# EAGLE design Board (EAGLE 7.7.0)
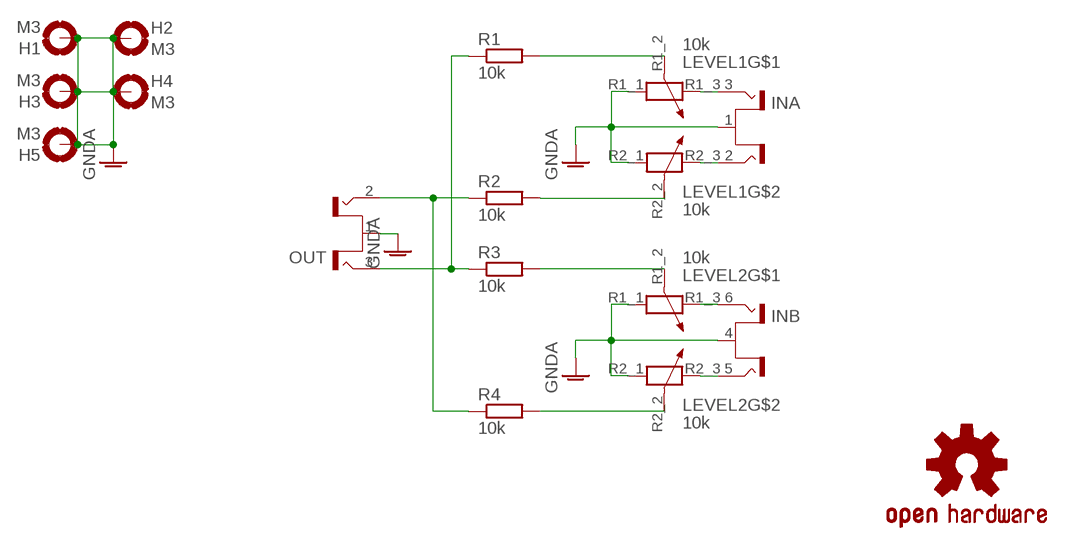
[diagram p0: schematic, sheet 1]

## Parts
H1  M3  MOUNT-PAD-ROUND3.0  [3,0-PAD]
H2  M3  MOUNT-PAD-ROUND3.0  [3,0-PAD]
H3  M3  MOUNT-PAD-ROUND3.0  [3,0-PAD]
H4  M3  MOUNT-PAD-ROUND3.0  [3,0-PAD]
H5  M3  MOUNT-PAD-ROUND3.0  [3,0-PAD]
IN  RCA-4-117-01  [RCA-4-117-01]
LEVEL1  10k  ALPS-RK09L12B0  [ALPS-RK09L12B0]
LEVEL2  10k  ALPS-RK09L12B0  [ALPS-RK09L12B0]
LOGO1  OSHW-LOGOL-COPPER  [OSHW-LOGO-L_COPPER]
OUT  RCA-2-117-01  [RCA-2-117-01]
R1  10k  R-EU_0414/15  [0414/15]
R2  10k  R-EU_0414/15  [0414/15]
R3  10k  R-EU_0414/15  [0414/15]
R4  10k  R-EU_0414/15  [0414/15]

## Nets
GNDA: H1.B3,0(MOUNT) H2.B3,0(MOUNT) H3.B3,0(MOUNT) H4.B3,0(MOUNT) H5.B3,0(MOUNT) IN.1(A:S) IN.4(B:S) LEVEL1.R1_1 LEVEL1.R2_1 LEVEL2.R1_1 LEVEL2.R2_1 OUT.1(S)
N$1: IN.6(B:T2) LEVEL2.R1_3
N$2: IN.3(A:T2) LEVEL1.R1_3
N$3: IN.2(A:T1) LEVEL1.R2_3
N$4: LEVEL1.R1_2 R1.2
N$5: LEVEL1.R2_2 R2.2
N$6: IN.5(B:T1) LEVEL2.R2_3
N$9: LEVEL2.R2_2 R4.2
N$10: LEVEL2.R1_2 R3.2
N$11: OUT.2(T1) R2.1 R4.1
N$12: OUT.3(T2) R1.1 R3.1

## Library data of the parts
H1-H5 = holes:MOUNT-PAD-ROUND: MOUNTING PAD, round
IN = con-conrad:RCA-4-117-01: Cinch-Anschlussplatte 72385 Gold, Rot, Weiß BKL Electronic Conrad Bestellnummer : 736910 - 62 Source: Data sheet <http://www.produktinfo.conrad.com/datenblaetter/725000-749999/736910-da-01-en-Cinch_Anschlussplatte_4polig.pdf>
LEVEL1 LEVEL2 = OwnStuff:ALPS-RK09L12B0
LOGO1 = SparkFun-Aesthetics:OSHW-LOGO: Open Source Hardware Logo This logo indicates the piece of hardware it is found on incorporates a OSHW license and/or adheres to the definition of open source hardware found here: http://freedomdefined.org/OSHW
OUT = con-conrad:RCA-2-117-01: Cinch-Anschlussplatte 72385 Gold, Rot, Weiß BKL Electronic Conrad Bestellnummer : 736910 - 62 Source: Data sheet <http://www.produktinfo.conrad.com/datenblaetter/725000-749999/736910-da-01-en-Cinch_Anschlussplatte_4polig.pdf>
R1-R4 = rcl:R-EU_: RESISTOR, European symbol

## Board
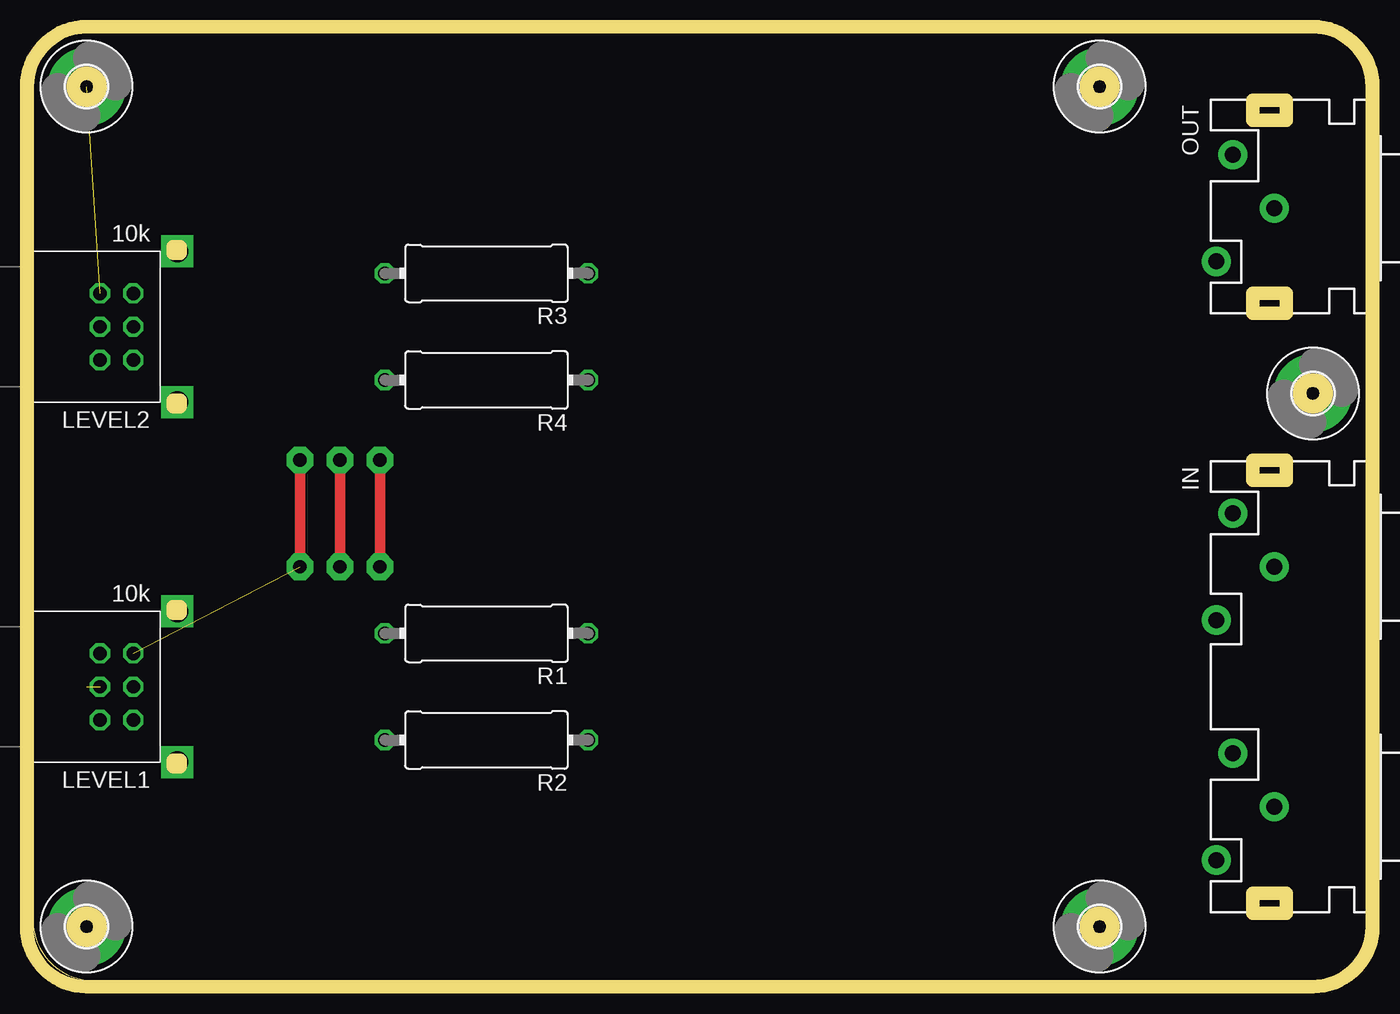
[diagram p1: board, top side]
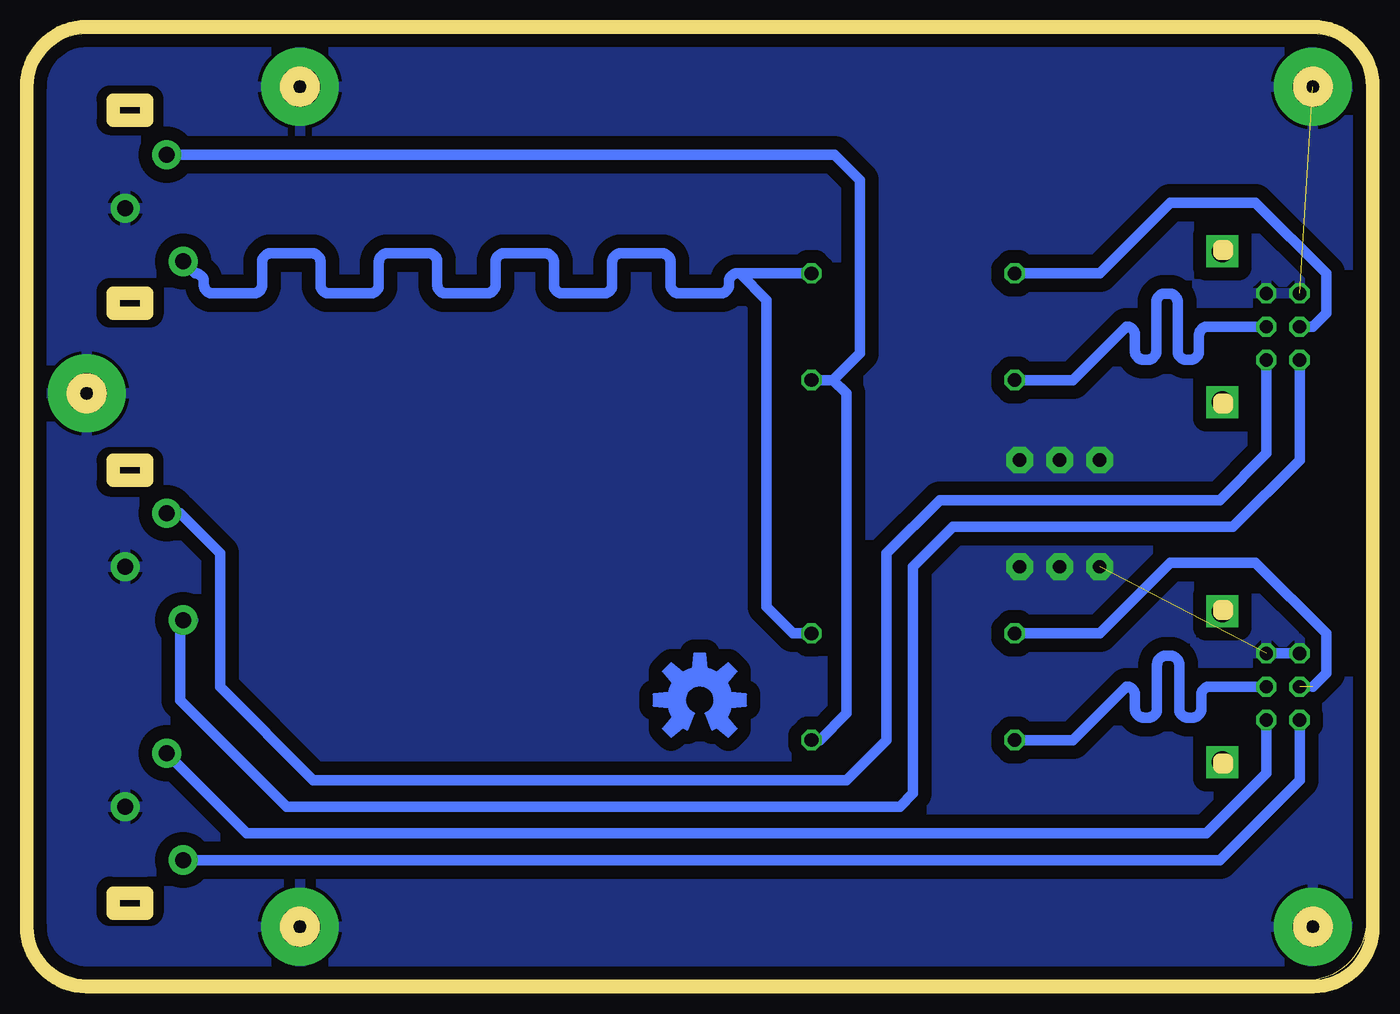
[diagram p2: board, bottom side, seen from below]

Size 100 x 71.03 mm. Coordinates in mm from the lower left corner, seen from the top.
Outline: 0,4.03 arc90 5,0.03 96,0.03 arc90 100,4.03 100,67.03 arc90 96,71.03 4,71.03 arc90 0,67.03 0,4.03
Copper layers (1*16): Top 0.035mm / dielectric 1.5mm / Bottom 0.035mm
Design rules "default *": minimum track width 10mil, minimum drill 24mil, track to track 8mil, track to pad 8mil, pad to pad 8mil, via to via 8mil, smd to smd 8mil, copper to edge 40mil, drill to drill 8mil, minimum pad ring 10mil, minimum via ring 8mil, stop-mask expansion 4mil, vias tented up to drill 0mil, thermal gap 10mil
Milling: 60 lines

### Footprints (pad centres in the part's own frame; a part is rotated, then mirrored left to right if it is on the bottom)
3,0-PAD = drill 3 pad 5.842: B3,0 0,0
RCA-4-117-01 = drill 1.2 pad 2.184: 1 9,3.1; 2 5,0; 3 13,-1.25; 4 -9,3.1; 5 -13,0; 6 -5,-1.25
ALPS-RK09L12B0 = drill 1 octagon: R1_1 2.5,-2.5; R1_2 2.5,0; R1_3 2.5,2.5; R2_1 0,-2.5; R2_2 0,0; R2_3 0,2.5 | drill 1.6 square: S1 -3.3,5.65; S2 -3.3,-5.65
RCA-2-117-01 = drill 1.2 pad 2.184: 1 0.11,3.1; 2 -3.89,0; 3 4.11,-1.25
0414/15 = drill 1.016 octagon: 1 -7.62,0; 2 7.62,0

### Placement (x,y rotation side)
H1  4,4.03 0 top
H2  4,67.03 0 top
H3  80,4.03 0 top
H4  96,44.03 0 top
H5  80,67.03 0 top
IN  90,22.03 270 top
LEVEL1  7.5,22.03 180 top
LEVEL2  7.5,49.03 180 top
LOGO1  50,21.03 0 bottom
OUT  90,58.03 270 top
R1  34,26.03 180 top
R2  34,18.03 180 top
R3  34,53.03 180 top
R4  34,45.03 180 top

### Tracks (layer width: path | path; a pad name or v marks a point on that pad's centre or on a via)
GNDA  (via drill 1 pad 2)  (2 unrouted)
  Top 0.8: v20,31.03 v20,39.03 | v23,31.03 v23,39.03 | v26,39.03 v26,31.03
  Bottom 0.8: LEVEL1.R1_1 LEVEL1.R2_1
  pour Bottom (isolate 1): 0,0.03 100,0.03 100,71.03 0,71.03
N$1
  Bottom 0.8: LEVEL2.R1_3 5,39.03 10,34.03 31,34.03 34,31.03 34,14.03 35,13.03 81,13.03 89,21.03 89,26.78 IN.6 88,27.03
N$2
  Bottom 0.8: LEVEL1.R1_3 5,15.03 11,9.03 IN.3
N$3
  Bottom 0.8: LEVEL1.R2_3 7.5,15.53 12,11.03 84,11.03 IN.2
N$4  (1 unrouted)
  Bottom 0.8: R1.2 20,26.03 14.69,31.33 8.31,31.33 3,26.03 3,23.03 4,22.03
N$5
  Bottom 0.8: R2.2 22,18.03 18,22.03 arc90 17.35,21.37 17.35,20.36 arc-90 16.69,19.71 16.34,19.71 arc-90 15.69,20.36 15.69,23.69 arc90 15.04,24.34 14.69,24.34 arc90 14.03,23.69 14.03,20.36 arc-90 13.38,19.71 13.03,19.71 arc-90 12.38,20.36 12.38,21.37 arc90 11.72,22.03 LEVEL1.R2_2
N$6
  Bottom 0.8: LEVEL2.R2_3 7.5,39.53 11,36.03 32,36.03 36,32.03 36,18.03 39,15.03 79,15.03 86,22.03 86,32.03 89,35.03 IN.5
N$9
  Bottom 0.8: R4.2 22,45.03 18,49.03 arc90 17.35,48.37 17.35,47.2 arc-90 16.69,46.54 16.4,46.54 arc-90 15.74,47.2 15.74,50.86 arc90 15.09,51.51 14.8,51.51 arc90 14.14,50.86 14.14,47.2 arc-90 13.49,46.54 13.2,46.54 arc-90 12.54,47.2 12.54,48.37 arc90 11.89,49.03 LEVEL2.R2_2
N$10
  Bottom 0.8: LEVEL2.R1_2 4,49.03 3,50.03 3,53.03 8.31,58.33 14.69,58.33 20,53.03 R3.2
  Bottom 0.813: 5.01,48.92 LEVEL2.R1_2
N$11
  Bottom 0.8: OUT.2 39.89,61.92 38,60.03 38,47.03 40,45.03 | 40,45.03 R4.1 | R2.1 41,18.03 39,20.03 39,44.03 40,45.03
N$12
  Bottom 0.8: R3.1 47,53.03 | R1.1 43,26.03 45,28.03 45,51.03 47,53.03 | 47,53.03 47.16,53.03 arc-90 47.81,52.37 47.81,52.18 arc90 48.47,51.52 51.54,51.52 arc90 52.19,52.18 52.19,53.88 arc-90 52.84,54.53 55.91,54.53 arc-90 56.57,53.88 56.57,52.18 arc90 57.22,51.52 60.29,51.52 arc90 60.94,52.18 60.94,53.88 arc-90 61.6,54.53 64.67,54.53 arc-90 65.32,53.88 65.32,52.18 arc90 65.97,51.52 69.04,51.52 arc90 69.7,52.18 69.7,53.88 arc-90 70.35,54.53 73.42,54.53 arc-90 74.08,53.88 74.08,52.18 arc90 74.73,51.52 77.8,51.52 arc90 78.45,52.18 78.45,53.88 arc-90 79.11,54.53 82.17,54.53 arc-90 82.83,53.88 82.83,52.18 arc90 83.48,51.52 86.55,51.52 arc90 87.21,52.18 87.21,52.37 arc-90 87.86,53.03 OUT.3